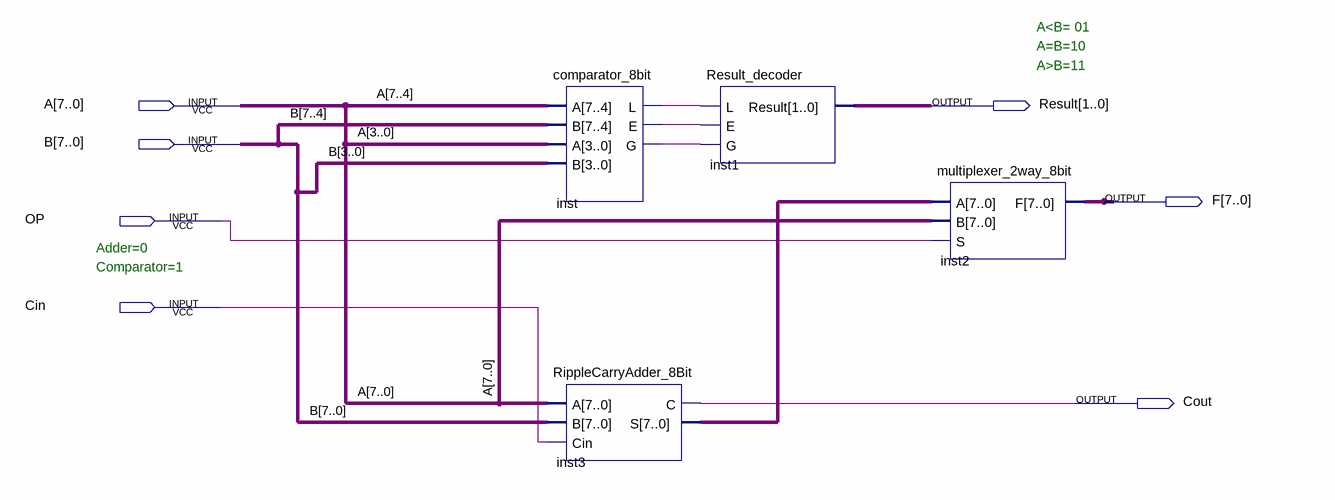
[diagram p0: schematic sheet]
// Quartus schematic ALU_8bit.bdf as structural Verilog: 4 symbols, 7 pins
module ALU_8bit (
  input  [7:0] A,
  input  [7:0] B,
  input  OP,
  input  Cin,
  output [1:0] Result,
  output [7:0] F,
  output Cout
);

  wire inst_e, inst_g, inst_l;
  wire [7:0] inst3_s;

  comparator_8bit inst (.A(A), .B(B), .L(inst_l), .E(inst_e), .G(inst_g));
  RippleCarryAdder_8Bit inst3 (.A(A), .B(B), .Cin(Cin), .C(Cout), .S(inst3_s));
  Result_decoder inst1 (.L(inst_l), .E(inst_e), .G(inst_g), .Result(Result));
  multiplexer_2way_8bit inst2 (.A(inst3_s), .B(A), .S(OP), .F(F));

  // Notes on the sheet:
  //   A<B= 01
  //   A=B=10
  //   A>B=11
  //   Adder=0
  //   Comparator=1
endmodule
